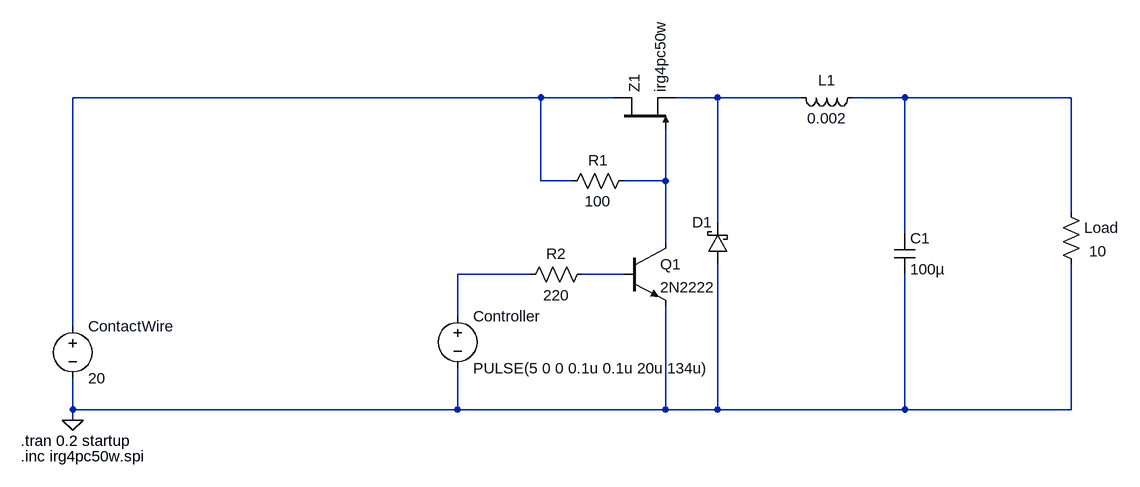
[diagram p0: schematic dc_dc_converter_with_capacitor_and_inductance_losses.asc]
dc_dc_converter_with_capacitor_and_inductance_losses.asc, the LTspice schematic file:
Version 4
SHEET 1 5120 680
WIRE 2752 -288 2032 -288
WIRE 2864 -288 2752 -288
WIRE 3024 -288 2960 -288
WIRE 3152 -288 3024 -288
WIRE 3312 -288 3232 -288
WIRE 3568 -288 3312 -288
WIRE 2752 -160 2752 -288
WIRE 2800 -160 2752 -160
WIRE 2944 -160 2944 -240
WIRE 2944 -160 2880 -160
WIRE 3568 -112 3568 -288
WIRE 3024 -96 3024 -288
WIRE 3312 -80 3312 -288
WIRE 2944 -64 2944 -160
WIRE 2736 -16 2624 -16
WIRE 2880 -16 2816 -16
WIRE 2624 48 2624 -16
WIRE 2032 64 2032 -288
WIRE 2032 192 2032 144
WIRE 2624 192 2624 128
WIRE 2624 192 2032 192
WIRE 2944 192 2944 32
WIRE 2944 192 2624 192
WIRE 3024 192 3024 -32
WIRE 3024 192 2944 192
WIRE 3312 192 3312 -16
WIRE 3312 192 3024 192
WIRE 3568 192 3568 -32
WIRE 3568 192 3312 192
WIRE 2032 208 2032 192
FLAG 2032 208 0
SYMBOL voltage 2032 48 R0
WINDOW 123 0 0 Left 0
WINDOW 39 0 0 Left 0
SYMATTR InstName ContactWire
SYMATTR Value 20
SYMBOL Misc\\NIGBT 2864 -240 R270
SYMATTR InstName Z1
SYMATTR Value irg4pc50w
SYMATTR Prefix X
SYMBOL ind 3248 -304 R90
WINDOW 0 5 56 VBottom 2
WINDOW 3 32 56 VTop 2
SYMATTR InstName L1
SYMATTR Value 0.002
SYMATTR SpiceLine Rser=0.4
SYMBOL schottky 3040 -32 R180
WINDOW 0 24 64 Left 2
WINDOW 3 24 0 Invisible 2
SYMATTR InstName D1
SYMATTR Value RBR30T60A
SYMATTR Description Diode
SYMATTR Type diode
SYMBOL res 3552 -128 R0
WINDOW 3 44 76 Left 2
SYMATTR Value 10
SYMATTR InstName Load
SYMBOL res 2896 -176 R90
WINDOW 0 0 56 VBottom 2
WINDOW 3 32 56 VTop 2
SYMATTR InstName R1
SYMATTR Value 100
SYMBOL npn 2880 -64 R0
SYMATTR InstName Q1
SYMATTR Value 2N2222
SYMBOL voltage 2624 32 R0
WINDOW 123 0 0 Left 0
WINDOW 39 0 0 Left 0
SYMATTR InstName Controller
SYMATTR Value PULSE(5 0 0 0.1u 0.1u 20u 134u)
SYMBOL res 2832 -32 R90
WINDOW 0 0 56 VBottom 2
WINDOW 3 32 56 VTop 2
SYMATTR InstName R2
SYMATTR Value 220
SYMBOL cap 3296 -80 R0
SYMATTR InstName C1
SYMATTR Value 100µ
TEXT 1952 240 Left 2 !.tran 0.2 startup
TEXT 1952 264 Left 2 !.inc irg4pc50w.spi

The netlist it stands for:
* dc_dc_converter_with_capacitor_and_inductance_losses.asc
V§ContactWire N001 0 20
XZ1 N001 N004 N002 irg4pc50w  ; pins C G E
L1 N003 N002 0.002 Rser=0.4
D1 0 N002 RBR30T60A
R§Load N003 0 10
R1 N004 N001 100
Q1 N004 N006 0 0 2N2222
V§Controller N005 0 PULSE(5 0 0 0.1u 0.1u 20u 134u)
R2 N006 N005 220
C1 N003 0 100µ
.model D D
.lib standard.dio
.model NPN NPN
.model PNP PNP
.lib standard.bjt
.tran 0.2 startup
.inc irg4pc50w.spi
.backanno
.end